# EAGLE schematic untitled (EAGLE 9.5.1)
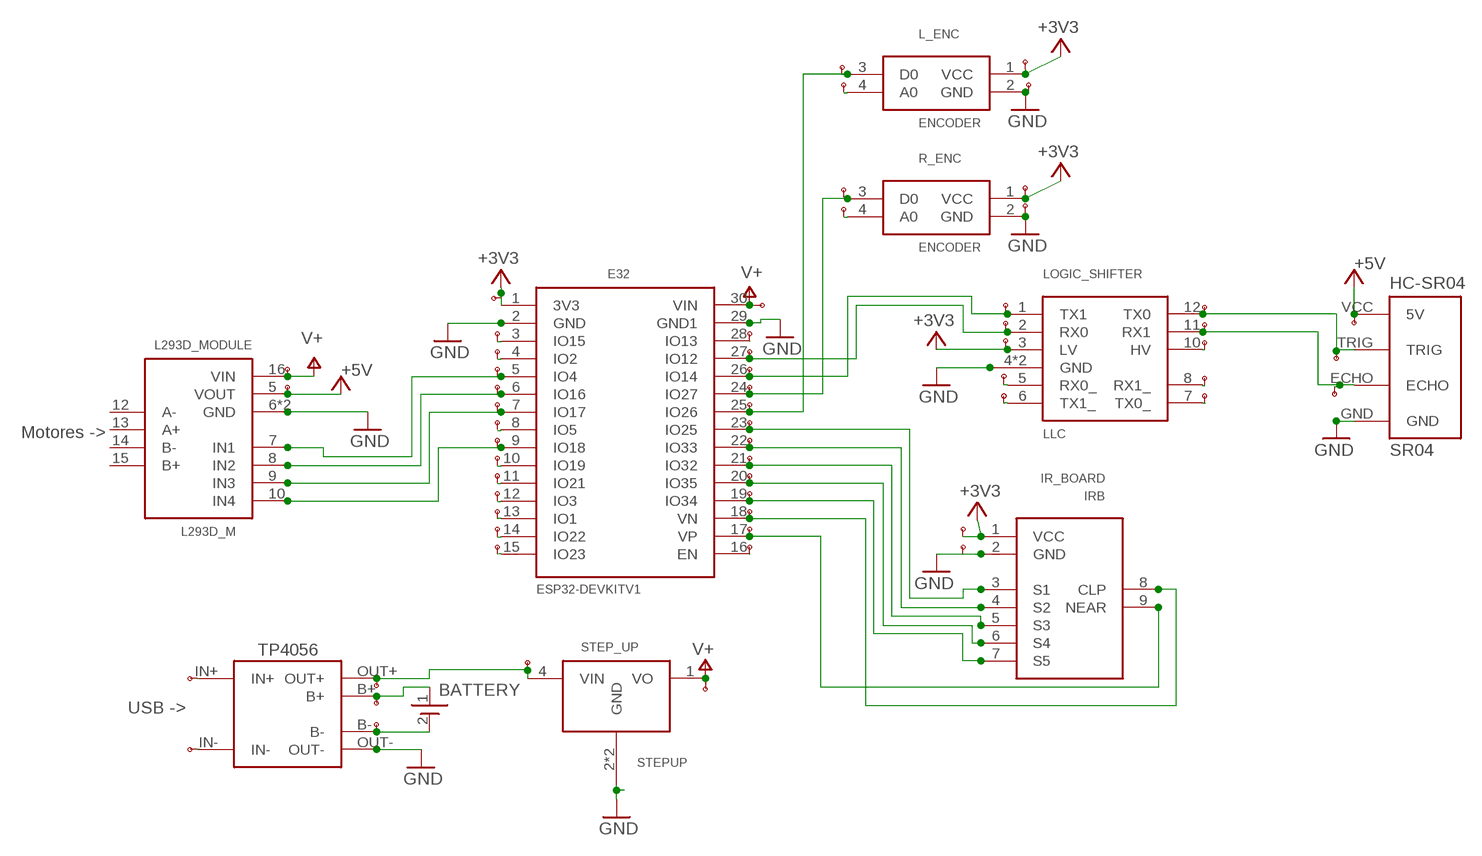
[diagram p0: schematic, sheet 1]

## Parts
BAT_CHARGER  TP4056-MODULE  [TP4056-LITHIUM-PROTECTED-MODULE]
BATTERY  BAT_PAD  [BAT_PAD]
E32  ESP32DEVKITV1  [ESP32-DEVKITV1]
IR_BOARD  IRB  [IRB]
L293D_MODULE  L293D_M  [L293D_M]
L_ENC  ENCODER  [ENCODER]
LOGIC_SHIFTER  LLC  [LLC]
R_ENC  ENCODER  [ENCODER]
SR04  HC-SR04  [HC-SR04_FOOTPRINT]
STEP_UP  STEPUP  [STEPUP]
U$1  TP  [TP]
U$2  TP  [TP]
U$3  TP  [TP]
U$4  TP  [TP]
U$8  TP  [TP]
U$10  TP  [TP]
U$11  TP  [TP]
U$12  TP  [TP]
U$13  TP  [TP]
U$14  TP  [TP]
U$15  TP  [TP]
U$16  TP  [TP]
U$17  TP  [TP]
U$18  TP  [TP]
U$19  TP  [TP]
U$20  TP  [TP]
U$21  TP  [TP]
U$22  TP  [TP]
U$23  TP  [TP]
U$24  TP  [TP]
U$25  TP  [TP]
U$26  TP  [TP]
U$27  TP  [TP]
U$28  TP  [TP]
U$29  TP  [TP]
U$30  TP  [TP]
U$31  TP  [TP]
U$32  TP  [TP]
U$33  TP  [TP]
U$34  TP  [TP]
U$36  TP  [TP]
U$37  TP  [TP]
U$38  TP  [TP]
U$40  TP  [TP]
U$41  TP  [TP]
U$42  TP  [TP]
U$43  TP  [TP]
U$44  TP  [TP]
U$46  TP  [TP]
U$47  TP  [TP]
U$48  TP  [TP]
U$49  TP  [TP]
U$50  TP  [TP]
U$51  TP  [TP]
U$52  TP  [TP]
U$53  TP  [TP]
U$54  TP  [TP]
U$55  TP  [TP]
U$56  TP  [TP]
U$57  TP  [TP]
U$59  TP  [TP]
U$60  TP  [TP]
U$61  TP  [TP]
U$62  TP  [TP]
U$63  TP  [TP]
U$64  TP  [TP]
U$65  TP  [TP]
U$67  TP  [TP]
U$68  TP  [TP]
U$69  TP  [TP]

## Nets
+3V3: E32.1(3V3) IR_BOARD.1(VCC) L_ENC.1(VCC) LOGIC_SHIFTER.3(LV) R_ENC.1(VCC) U$3.P$1 U$8.P$1 U$49.P$1 U$51.P$1 U$57.P$1
+5V: L293D_MODULE.5(VOUT) SR04.VCC(5V) U$2.P$1 U$69.P$1
GND: BAT_CHARGER.OUT- E32.2(GND) E32.29(GND1) IR_BOARD.2(GND) L293D_MODULE.6(GND) L293D_MODULE.11(GND) L_ENC.2(GND) LOGIC_SHIFTER.4(GND) LOGIC_SHIFTER.9(GND) R_ENC.2(GND) SR04.GND STEP_UP.2(GND) STEP_UP.3(GND) U$4.P$1 U$50.P$1 U$52.P$1
N$2: E32.5(IO4) L293D_MODULE.7(IN1) U$46.P$1
N$3: E32.6(IO16) L293D_MODULE.8(IN2) U$12.P$1
N$4: E32.7(IO17) L293D_MODULE.9(IN3) U$13.P$1
N$5: E32.9(IO18) L293D_MODULE.10(IN4) U$15.P$1
N$6: BAT_CHARGER.B+ BATTERY.1(+) U$41.P$1
N$7: BAT_CHARGER.B- BATTERY.2(-) U$40.P$1
N$8: BAT_CHARGER.OUT+ STEP_UP.4(VIN) U$42.P$1 U$43.P$1
N$9: E32.23(IO25) IR_BOARD.3(S1) U$29.P$1
N$10: E32.22(IO33) IR_BOARD.4(S2) U$28.P$1
N$11: E32.21(IO32) IR_BOARD.5(S3) U$27.P$1
N$12: E32.20(IO35) IR_BOARD.6(S4) U$26.P$1
N$13: E32.19(IO34) IR_BOARD.7(S5) U$25.P$1
N$14: E32.17(VP) IR_BOARD.9(NEAR) U$23.P$1
N$15: E32.18(VN) IR_BOARD.8(CLP) U$24.P$1
N$16: E32.27(IO12) LOGIC_SHIFTER.2(RX0) U$33.P$1 U$56.P$1
N$17: E32.26(IO14) LOGIC_SHIFTER.1(TX1) U$32.P$1 U$55.P$1
N$18: LOGIC_SHIFTER.12(TX0) SR04.TRIG U$65.P$1 U$68.P$1
N$19: LOGIC_SHIFTER.11(RX1) SR04.ECHO U$64.P$1 U$67.P$1
N$20: E32.24(IO27) R_ENC.3(D0) U$31.P$1 U$54.P$1
N$21: E32.25(IO26) L_ENC.3(D0) U$30.P$1 U$47.P$1
N$22: E32.15(IO23) U$21.P$1
N$23: E32.3(IO15) U$10.P$1
N$24: E32.4(IO2) U$11.P$1
N$25: E32.8(IO5) U$14.P$1
N$26: E32.10(IO19) U$16.P$1
N$27: E32.11(IO21) U$17.P$1
N$28: E32.12(IO3) U$18.P$1
N$29: E32.13(IO1) U$19.P$1
N$30: E32.14(IO22) U$20.P$1
N$32: E32.16(EN) U$22.P$1
N$33: E32.28(IO13) U$34.P$1
N$35: BAT_CHARGER.IN- U$38.P$1
N$36: BAT_CHARGER.IN+ U$37.P$1
N$37: LOGIC_SHIFTER.5(RX0_) U$59.P$1
N$38: LOGIC_SHIFTER.6(TX1_) U$60.P$1
N$39: LOGIC_SHIFTER.7(TX0_) U$61.P$1
N$40: LOGIC_SHIFTER.8(RX1_) U$62.P$1
N$41: LOGIC_SHIFTER.10(HV) U$63.P$1
N$42: R_ENC.4(A0) U$53.P$1
N$43: L_ENC.4(A0) U$48.P$1
V+: E32.30(VIN) L293D_MODULE.16(VIN) STEP_UP.1(VO) U$1.P$1 U$36.P$1 U$44.P$1
Unconnected: L293D_MODULE.12(A-) L293D_MODULE.13(A+) L293D_MODULE.14(B-) L293D_MODULE.15(B+)

## Notes on the sheet
- Motores ->
- TP4056
- USB ->

## Library data of the parts
BAT_CHARGER = UserLib:TP4056-MODULE
BATTERY = edurobotParts:BAT_PAD
E32 = ESP32-DEVKITV1:ESP32DEVKITV1
IR_BOARD = edurobotParts:IRB
L293D_MODULE = edurobotParts:L293D_M
L_ENC R_ENC = edurobotParts:ENCODER
LOGIC_SHIFTER = edurobotParts:LLC
SR04 = Ultrasonic Sensor HC-SR04:HC-SR04: Ultrasonic Sensor HC-SR04
STEP_UP = edurobotParts:STEPUP
U$1-U$4 U$8 U$10-U$34 U$36-U$38 U$40-U$44 U$46-U$57 U$59-U$65 U$67-U$69 = edurobotParts:TP